# Altium schematic sheet rf_connection_sch4.SchDoc
size A3
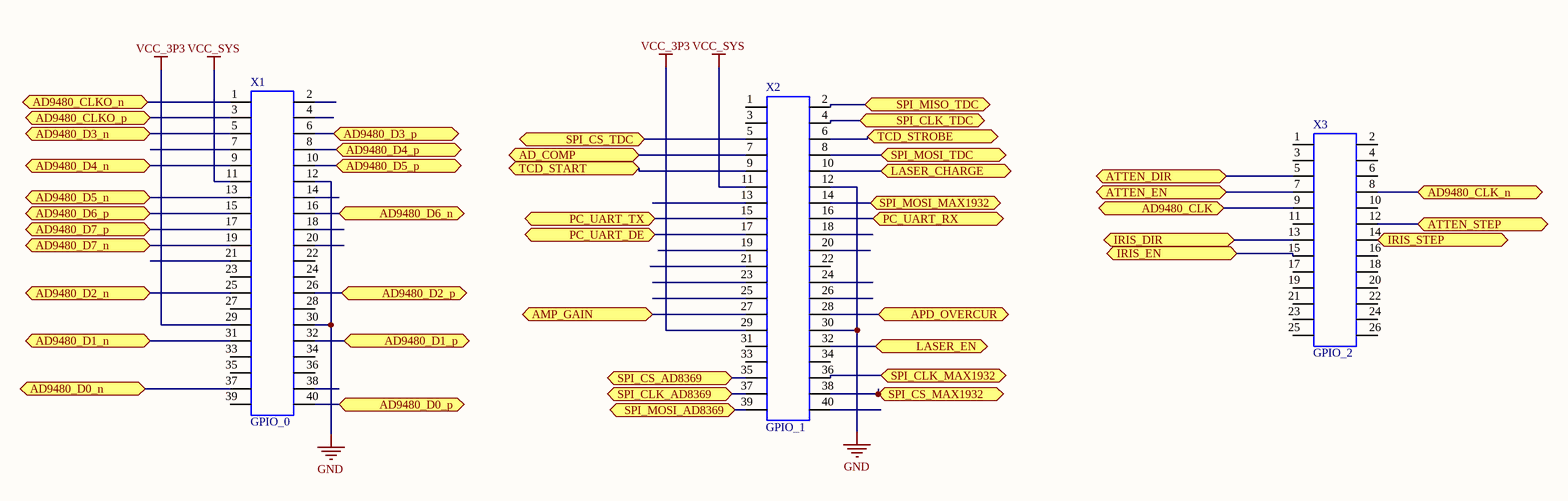
[diagram p0: rf_connection_sch4.SchDoc]

## Parts
X1  GPIO_0
X2  GPIO_1
X3  GPIO_2

## Ports
AD9480_CLK, AD9480_CLK_n, AD9480_CLKO_n, AD9480_CLKO_p, AD9480_D0_n, AD9480_D0_p, AD9480_D1_n, AD9480_D1_p, AD9480_D2_n, AD9480_D2_p, AD9480_D3_n, AD9480_D3_p, AD9480_D4_n, AD9480_D4_p, AD9480_D5_n, AD9480_D5_p, AD9480_D6_n, AD9480_D6_p, AD9480_D7_n, AD9480_D7_p, AD_COMP, AMP_GAIN, APD_OVERCUR, ATTEN_DIR, ATTEN_EN, ATTEN_STEP, IRIS_DIR, IRIS_EN, IRIS_STEP, LASER_CHARGE, LASER_EN, PC_UART_DE, PC_UART_RX, PC_UART_TX, SPI_CLK_AD8369, SPI_CLK_MAX1932, SPI_CLK_TDC, SPI_CS_AD8369, SPI_CS_MAX1932, SPI_CS_TDC, SPI_MISO_TDC, SPI_MOSI_AD8369, SPI_MOSI_MAX1932, SPI_MOSI_TDC, TCD_START, TCD_STROBE

## Nets
GND: X1.12 X1.30 X2.12 X2.30
VCC_3P3: X1.29 X2.29
VCC_SYS: X1.11 X2.11
AD9480_CLK: X3.9 ; port AD9480_CLK
AD9480_CLK_n: X3.8 ; port AD9480_CLK_n
AD9480_CLKO_n: X1.1 ; port AD9480_CLKO_n
AD9480_CLKO_p: X1.3 ; port AD9480_CLKO_p
AD9480_D0_n: X1.37 ; port AD9480_D0_n
AD9480_D0_p: X1.40 ; port AD9480_D0_p
AD9480_D1_n: X1.31 ; port AD9480_D1_n
AD9480_D1_p: X1.32 ; port AD9480_D1_p
AD9480_D2_n: X1.25 ; port AD9480_D2_n
AD9480_D2_p: X1.26 ; port AD9480_D2_p
AD9480_D3_n: X1.5 ; port AD9480_D3_n
AD9480_D3_p: X1.6 ; port AD9480_D3_p
AD9480_D4_n: X1.9 ; port AD9480_D4_n
AD9480_D4_p: X1.8 ; port AD9480_D4_p
AD9480_D5_n: X1.13 ; port AD9480_D5_n
AD9480_D5_p: X1.10 ; port AD9480_D5_p
AD9480_D6_n: X1.16 ; port AD9480_D6_n
AD9480_D6_p: X1.15 ; port AD9480_D6_p
AD9480_D7_n: X1.19 ; port AD9480_D7_n
AD9480_D7_p: X1.17 ; port AD9480_D7_p
AD_COMP: X2.7 ; port AD_COMP
AMP_GAIN: X2.27 ; port AMP_GAIN
APD_OVERCUR: X2.28 ; port APD_OVERCUR
ATTEN_DIR: X3.5 ; port ATTEN_DIR
ATTEN_EN: X3.7 ; port ATTEN_EN
ATTEN_STEP: X3.12 ; port ATTEN_STEP
IRIS_DIR: X3.13 ; port IRIS_DIR
IRIS_EN: X3.15 ; port IRIS_EN
IRIS_STEP: X3.14 ; port IRIS_STEP
LASER_CHARGE: X2.10 ; port LASER_CHARGE
LASER_EN: X2.32 ; port LASER_EN
PC_UART_DE: X2.17 ; port PC_UART_DE
PC_UART_RX: X2.16 ; port PC_UART_RX
PC_UART_TX: X2.15 ; port PC_UART_TX
SPI_CLK_AD8369: X2.37 ; port SPI_CLK_AD8369
SPI_CLK_MAX1932: X2.36 ; port SPI_CLK_MAX1932
SPI_CLK_TDC: X2.4 ; port SPI_CLK_TDC
SPI_CS_AD8369: X2.35 ; port SPI_CS_AD8369
SPI_CS_MAX1932: X2.38 ; port SPI_CS_MAX1932
SPI_CS_TDC: X2.5 ; port SPI_CS_TDC
SPI_MISO_TDC: X2.2 ; port SPI_MISO_TDC
SPI_MOSI_AD8369: X2.39 ; port SPI_MOSI_AD8369
SPI_MOSI_MAX1932: X2.14 ; port SPI_MOSI_MAX1932
SPI_MOSI_TDC: X2.8 ; port SPI_MOSI_TDC
TCD_START: X2.9 ; port TCD_START
TCD_STROBE: X2.6 ; port TCD_STROBE

Not connected (* = marked no-connect by the designer): X1 2 4 7 14 18 20 21 22 23 24 27 28 33 34 35 36 38 39; X2 1 3 13 18 19 20 21 22 23 24 25 26 31 33 34 40; X3 1 2 3 4 6 10 11 16 17 18 19 20 21 22 23 24 25 26

## Library data of the parts
X1 X2 = 40pin_2x
X3 = 26pin_2x